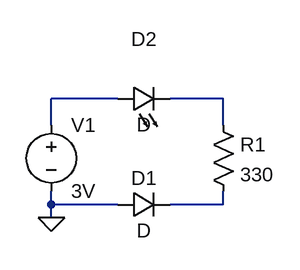
[diagram p0: schematic Reverse Bias.asc]
Reverse Bias.asc, the LTspice schematic file:
Version 4
SHEET 1 880 680
WIRE 112 64 32 64
WIRE 240 64 176 64
WIRE 32 96 32 64
WIRE 240 96 240 64
WIRE 32 192 32 176
WIRE 112 192 32 192
WIRE 240 192 240 176
WIRE 240 192 176 192
WIRE 32 208 32 192
FLAG 32 208 0
SYMBOL res 224 80 R0
SYMATTR InstName R1
SYMATTR Value 330
SYMBOL diode 112 208 R270
WINDOW 0 32 32 VTop 2
WINDOW 3 0 32 VBottom 2
SYMATTR InstName D1
SYMBOL LED 112 80 R270
WINDOW 0 72 32 VTop 2
WINDOW 3 0 32 VBottom 2
SYMATTR InstName D2
SYMBOL voltage 32 80 R0
WINDOW 123 0 0 Left 0
WINDOW 39 0 0 Left 0
SYMATTR InstName V1
SYMATTR Value 3V

The netlist it stands for:
* Reverse Bias.asc
R1 N002 N003 330
D1 0 N003 D
D2 N001 N002 D
V1 N001 0 3V
.model D D
.lib standard.dio
.backanno
.end